# EAGLE schematic StyroCutter-556-heatsink-5V-alt (EAGLE 7.6.0)
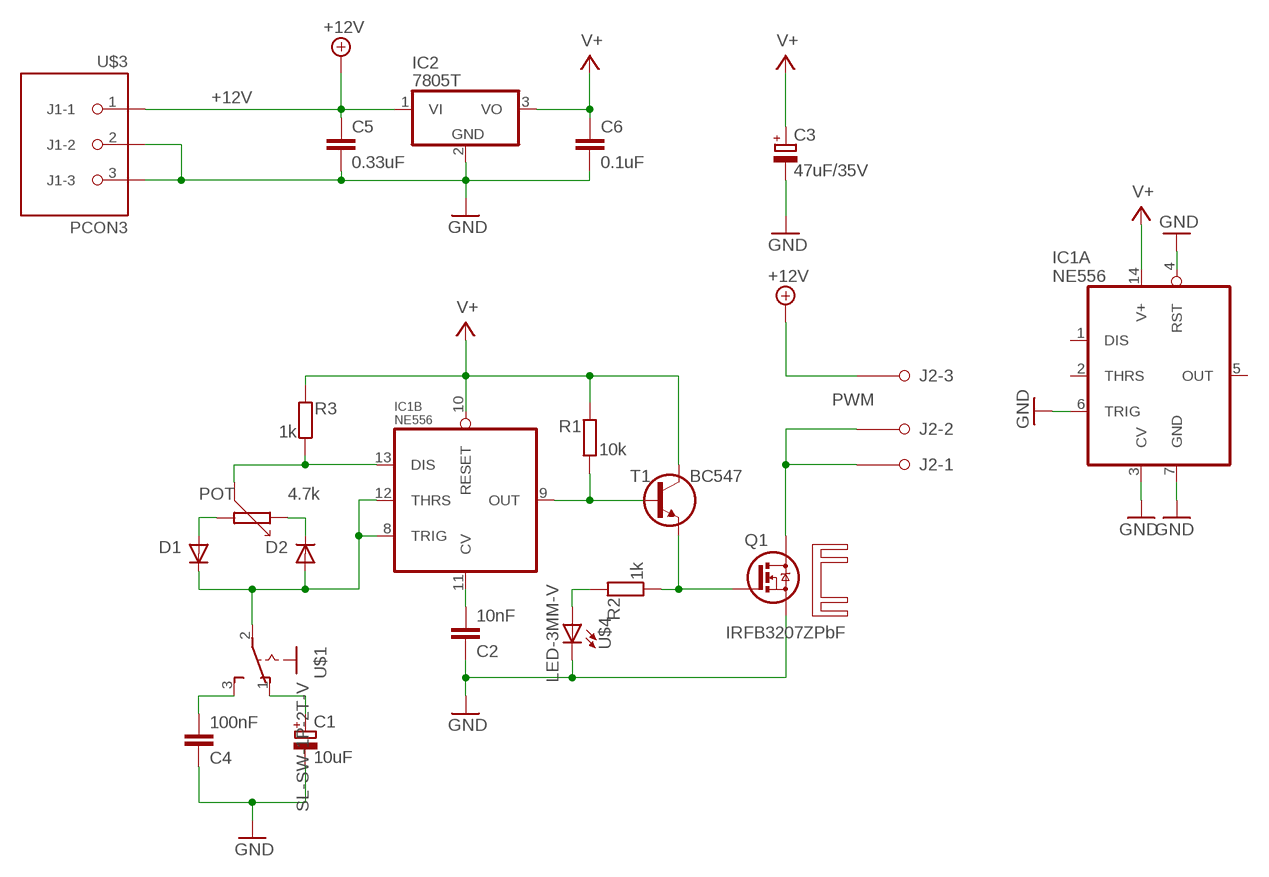
[diagram p0: schematic, sheet 1]

## Parts
C1  10uF  CPOL-EUE5-4  [E5-4]
C2  10nF  C075-032X103  [C075-032X103]
C3  47uF/35V  CPOL-EUE2.5-5  [E2,5-5]
C4  100nF  C050-020X036  [C050-020X036]
C5  0.33uF  C050-024X044  [C050-024X044]
C6  0.1uF  C050-025X075  [C050-025X075]
D1  1N4148  1N414834-5  [DO34-5]
D2  1N4148  1N414834-5  [DO34-5]
IC1  NE556  556-ALT-DIL14  [DIL14]
IC2  7805T  [TO220H]
J2  PCON3_MIGROS  [CON-MIGROS-3PIN]
POT  4.7k  PIHER-PT16S  [PC16S]
Q1  IRFB3207ZPbF  PMOSFET_NTO220BV  [TO220BV]
R1  10k  R0204/12  [0204/12]
R2  1k  R0204/10  [0204/10]
R3  1k  R0202/2V  [0202/2V]
T1  BC547  BC547CBE  [TO92-CBE]
U$1  SL-SW-1P-2T-V  [SLSW-1P2T-V]
U$2  AQ  [AQ_HS_3A]
U$3  PCON3  [CON-MIGROS-3PIN]
U$4  LED-3MM-V  [LED-3MM-V]

## Nets
+12V: C5.1 IC2.1(VI) J2.3 U$3.1(J1-1)
GND: C1.- C2.1 C3.- C4.1 C5.2 C6.2 IC1.3(A:CV) IC1.4(A:RST) IC1.6(A:TRIG) IC1.7(A:GND) IC2.2(GND) Q1.S U$3.2(J1-2) U$3.3(J1-3) U$4.C
N$1: D2.C POT.1A
N$2: D1.A POT.1E
N$3: IC1.9(B:OUT) R1.1 T1.B
N$4: C4.2 U$1.3(S)
N$5: C2.2 IC1.11(B:CV)
N$6: IC1.13(B:DIS) POT.1S R3.1
N$7: Q1.G R2.1 T1.E
N$8: D1.C D2.A IC1.8(B:TRIG) IC1.12(B:THRS) U$1.2(P)
N$9: C1.+ U$1.1(O)
N$11: R2.2 U$4.A
PWM: J2.1 J2.2 Q1.D
V+: C3.+ C6.1 IC1.10(B:RESET) IC1.14(A:V+) IC2.3(VO) R1.2 R3.2 T1.C
Unconnected: IC1.1(A:DIS) IC1.2(A:THRS) IC1.5(A:OUT)

## Library data of the parts
C1 C3 = rcl:CPOL-EU: POLARIZED CAPACITOR, European symbol
C2 C4-C6 = c:C: CAPACITOR, European symbol
D1 D2 = d:1N4148
IC1 = ne555-556:*556-ALT
IC2 = linear:78*: Positive VOLTAGE REGULATOR Source: http://cache.national.com/ds/LM/LM78L05.pdf http://www.fairchildsemi.com/ds/LM/LM7805.pdf
J2 = print-conn:PCON3_MIGROS
POT = piher-pt16:PIHER-PT16S
Q1 = power-mosfet:PMOSFET_N: Power MOSFET N-Channel
R1-R3 = r:R: RESISTOR, European symbol
T1 = t:BC547
U$1 = sw:SL-SW-1P-2T
U$2 = heatsink:AQ
U$3 = print-conn:PCON3
U$4 = led:LED

## Net classes
0 GND: width 1.219 mm, clearance 0.635 mm